# EAGLE design env_follower (EAGLE 9.5.2)
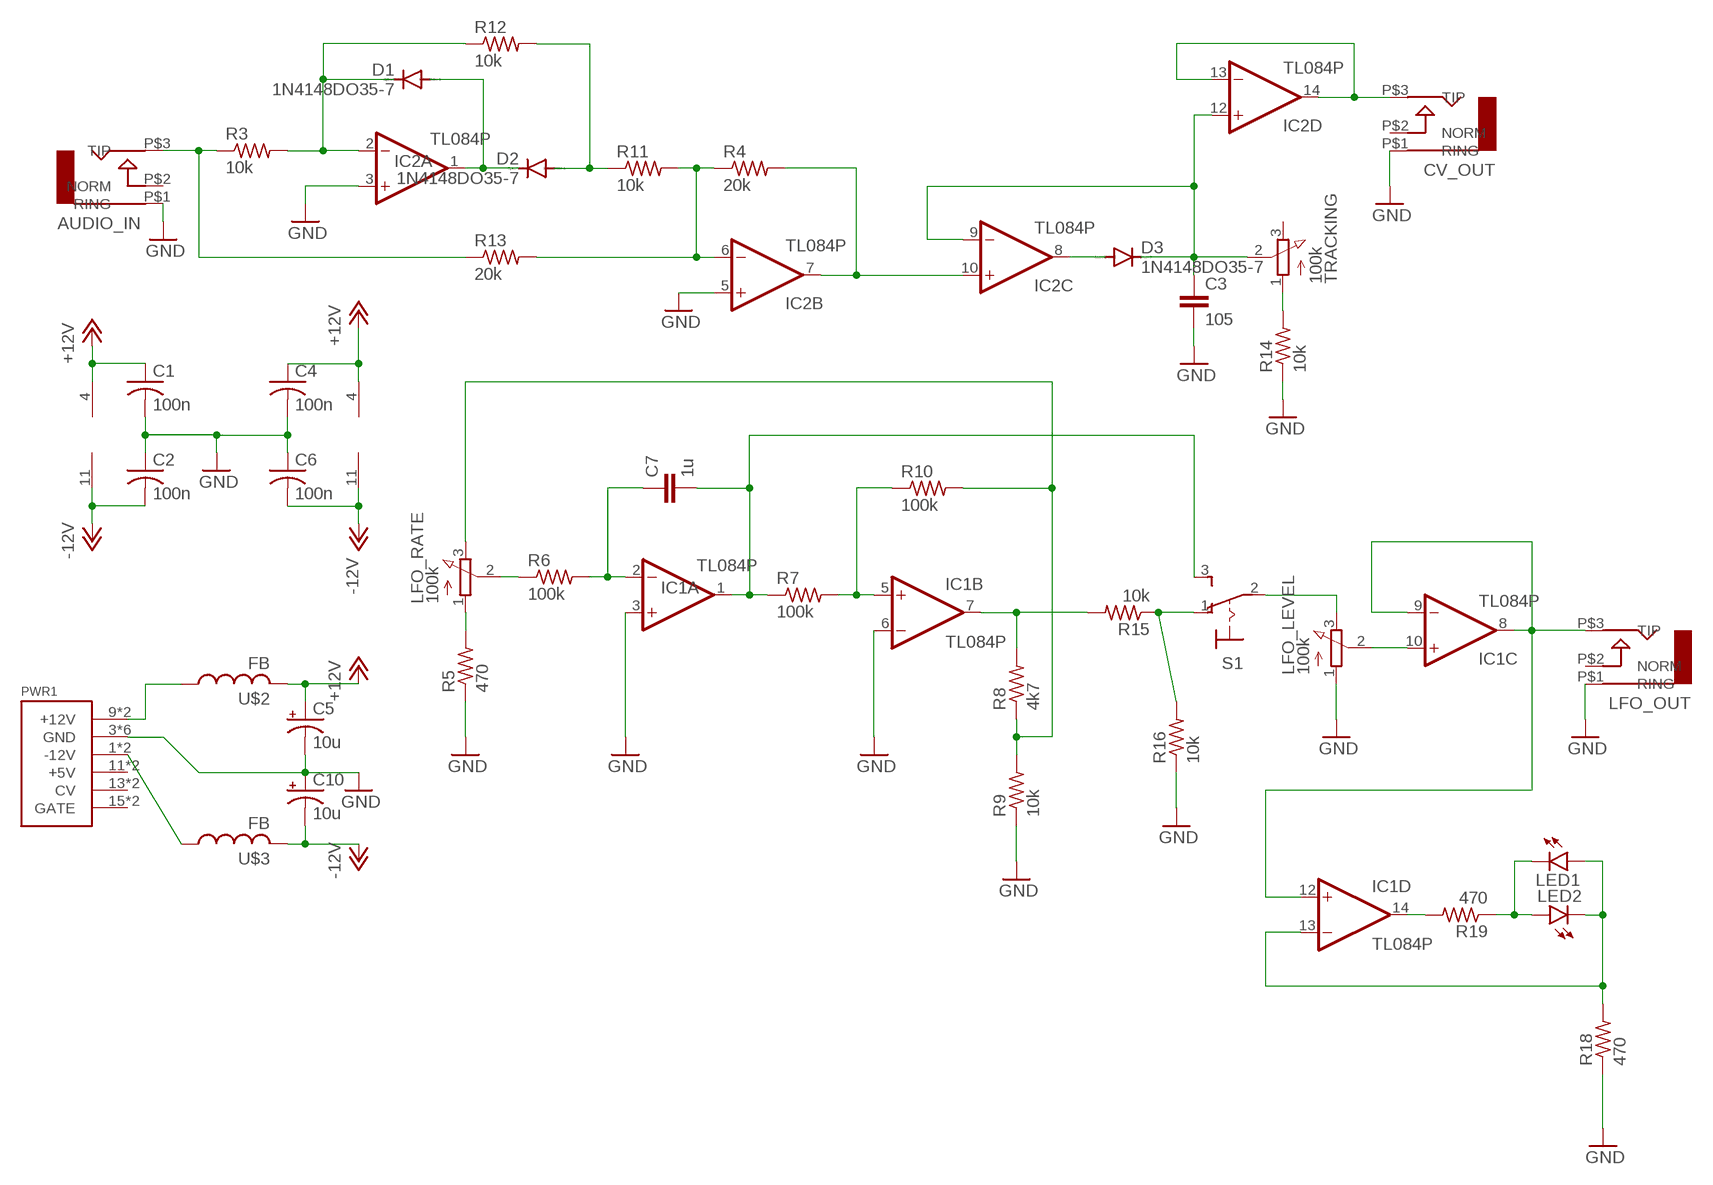
[diagram p0: schematic, sheet 1]

## Parts
AUDIO_IN  AUDIO-JACK  [ERTHENVAR-JACK-90DEG]
C1  100n  C-USC1206  [C1206]
C2  100n  C-USC1206  [C1206]
C3  105  C7.5/3  [C7.5B3]
C4  100n  C-USC1206  [C1206]
C5  10u  CPOL-USB45181A  [B45181A]
C6  100n  C-USC1206  [C1206]
C7  1u  C5/2.5  [C5B2.5]
C10  10u  CPOL-USB45181A  [B45181A]
CV_OUT  AUDIO-JACK  [ERTHENVAR-JACK-90DEG]
D1  1N4148DO35-7  [DO35-7]
D2  1N4148DO35-7  [DO35-7]
D3  1N4148DO35-7  [DO35-7]
IC1  TL084P  [DIL14]
IC2  TL084P  [DIL14]
LED1  LED3MM  [LED3MM]
LED2  LED3MM  [LED3MM]
LFO_LEVEL  100k  3RP/1610N  [3RP/1610N]
LFO_OUT  AUDIO-JACK  [ERTHENVAR-JACK-90DEG]
LFO_RATE  100k  3RP/1610N  [3RP/1610N]
PWR1  POWER  [POWER_16]
R3  10k  R-US_0207/7  [0207/7]
R4  20k  R-US_0207/7  [0207/7]
R5  470  R-US_0207/7  [0207/7]
R6  100k  R-US_0207/7  [0207/7]
R7  100k  R-US_0207/7  [0207/7]
R8  4k7  R-US_0207/7  [0207/7]
R9  10k  R-US_0207/7  [0207/7]
R10  100k  R-US_0207/7  [0207/7]
R11  10k  R-US_0207/7  [0207/7]
R12  10k  R-US_0207/7  [0207/7]
R13  20k  R-US_0207/7  [0207/7]
R14  10k  R-US_0207/7  [0207/7]
R15  10k  R-US_0207/7  [0207/7]
R16  10k  R-US_0207/7  [0207/7]
R18  470  R-US_0207/7  [0207/7]
R19  470  R-US_0207/7  [0207/7]
S1  M9040P  [M9040P]
TRACKING  100k  3RP/1610N  [3RP/1610N]
U$2  FB  [FB]
U$3  FB  [FB]

## Nets
+12V: C1.1 C4.1 C5.+ IC1.4(P:V+) IC2.4(P:V+) U$2.P$2
-12V: C2.2 C6.2 C10.- IC1.11(P:V-) IC2.11(P:V-) U$3.P$2
GND: AUDIO_IN.P$1(RING) C1.2 C2.1 C3.2 C4.2 C5.- C6.1 C10.+ CV_OUT.P$1(RING) IC1.3(A:+IN) IC1.6(B:-IN) IC2.3(A:+IN) IC2.5(B:+IN) LFO_LEVEL.1(A) LFO_OUT.P$1(RING) PWR1.3(GND) PWR1.4(GND) PWR1.5(GND) PWR1.6(GND) PWR1.7(GND) PWR1.8(GND) R5.1 R9.1 R14.1 R16.1 R18.1
N$1: LFO_RATE.1(A) R5.2
N$2: D1.C IC2.2(A:-IN) R3.2 R12.1
N$3: D1.A D2.C IC2.1(A:OUT)
N$4: D2.A R11.1 R12.2
N$5: CV_OUT.P$3(TIP) IC2.13(D:-IN) IC2.14(D:OUT)
N$6: LFO_RATE.2(S) R6.1
N$7: C7.1 IC1.2(A:-IN) R6.2
N$8: IC2.7(B:OUT) IC2.10(C:+IN) R4.2
N$9: AUDIO_IN.P$3(TIP) R3.1 R13.1
N$10: C7.2 IC1.1(A:OUT) R7.1 S1.3(S)
N$11: PWR1.9(+12V) PWR1.10(+12V) U$2.P$1
N$12: IC1.5(B:+IN) R7.2 R10.1
N$13: IC1.7(B:OUT) R8.2 R15.2
N$14: R15.1 R16.2 S1.1(O)
N$15: D3.A IC2.8(C:OUT)
N$16: LFO_RATE.3(E) R8.1 R9.2 R10.2
N$17: PWR1.1(-12V) PWR1.2(-12V) U$3.P$1
N$18: IC1.8(C:OUT) IC1.9(C:-IN) IC1.12(D:+IN) LFO_OUT.P$3(TIP)
N$19: LFO_LEVEL.3(E) S1.2(P)
N$20: IC2.6(B:-IN) R4.1 R11.2 R13.2
N$21: C3.1 D3.C IC2.9(C:-IN) IC2.12(D:+IN) TRACKING.2(S)
N$22: R14.2 TRACKING.1(A)
N$23: IC1.10(C:+IN) LFO_LEVEL.2(S)
N$24: IC1.14(D:OUT) R19.2
N$25: LED1.K(C) LED2.A R19.1
N$27: IC1.13(D:-IN) LED1.A LED2.K(C) R18.2
Unconnected: AUDIO_IN.P$2(NORM) CV_OUT.P$2(NORM) LFO_OUT.P$2(NORM) PWR1.11(+5V) PWR1.12(+5V) PWR1.13(CV) PWR1.14(CV) PWR1.15(GATE) PWR1.16(GATE) TRACKING.3(E)

## Library data of the parts
AUDIO_IN CV_OUT LFO_OUT = erthenvar:AUDIO-JACK: Switching Mono 3.5mm Audio Jack from Erthenvar.
C1 C2 C4 C6 = rcl:C-US: CAPACITOR, American symbol
C3 C7 = capacitor-wima:C: CAPACITOR naming: grid - package width
C5 C10 = rcl:CPOL-US: POLARIZED CAPACITOR, American symbol
D1-D3 = diode:1N4148: DIODE high speed (Philips)
IC1 IC2 = linear:TL084: OP AMP
LED1 LED2 = led:LED: LED OSRAM: - CHIPLED LG R971, LG N971, LY N971, LG Q971, LY Q971, LO R971, LY R971 LH N974, LH R974 LS Q976, LO Q976, LY Q976 LO Q996 - Hyper CHIPLED LW Q18S LB Q993, LB Q99A, LB R99A - SideLED LS A670, LO A670, LY A670, LG A670, LP A670 LB A673, LV A673, LT A673, LW A673 LH A674 LY A675 LS A676, LA A676, LO A676, LY A676, LW A676 LS A679, LY A679, LG A679 - Hyper Micro SIDELED® LS Y876, LA Y876, LO Y876, LY Y876 LT Y87S - SmartLED LW L88C, LW L88S LB L89C, LB L89S, LG L890 LS L89K, LO L89K, LY L89K LS L896, LA L896, LO L896, LY L896 - TOPLED LS T670, LO T670, LY T670, LG T670, LP T670 LSG T670, LSP T670, LSY T670, LOP T670, LYG T670 LG T671, LOG T671, LSG T671 LB T673, LV T673, LT T673, LW T673 LH T674 LS T676, LA T676, LO T676, LY T676, LB T676, LH T676, LSB T676, LW T676 LB T67C, LV T67C, LT T67C, LS T67K, LO T67K, LY T67K, LW E67C LS E67B, LA E67B, LO E67B, LY E67B, LB E67C, LV E67C, LT E67C LW T67C LS T679, LY T679, LG T679 LS T770, LO T770, LY T770, LG T770, LP T770 LB T773, LV T773, LT T773, LW T773 LH T774 LS E675, LA E675, LY E675, LS T675 LS T776, LA T776, LO T776, LY T776, LB T776 LHGB T686 LT T68C, LB T68C - Hyper Mini TOPLED® LB M676 - Mini TOPLED Santana® LG M470 LS M47K, LO M47K, LY M47K Source: http://www.osram.convergy.de LUXEON: - LUMILED® LXK2-PW12-R00, LXK2-PW12-S00, LXK2-PW14-U00, LXK2-PW14-V00 LXK2-PM12-R00, LXK2-PM12-S00, LXK2-PM14-U00 LXK2-PE12-Q00, LXK2-PE12-R00, LXK2-PE12-S00, LXK2-PE14-T00, LXK2-PE14-U00 LXK2-PB12-K00, LXK2-PB12-L00, LXK2-PB12-M00, LXK2-PB14-N00, LXK2-PB14-P00, LXK2-PB14-Q00 LXK2-PR12-L00, LXK2-PR12-M00, LXK2-PR14-Q00, LXK2-PR14-R00 LXK2-PD12-Q00, LXK2-PD12-R00, LXK2-PD12-S00 LXK2-PH12-R00, LXK2-PH12-S00 LXK2-PL12-P00, LXK2-PL12-Q00, LXK2-PL12-R00 Source: www.luxeon.com KINGBRIGHT: KA-3528ASYC Source: www.kingbright.com
LFO_LEVEL LFO_RATE TRACKING = pot:3RP/1610N: 16mm Potentiometer one level Source: http://www.alphapotentiometers.net/html/16mm_pot_2.html
PWR1 = eurorack:POWER
R3-R16 R18 R19 = rcl:R-US_: RESISTOR, American symbol
S1 = switch:M9040P: TOGGLE SWITCH Marquardt
U$2 U$3 = adafruit:FB: Ferrite bead Digikey #P9821BK-ND

## Board
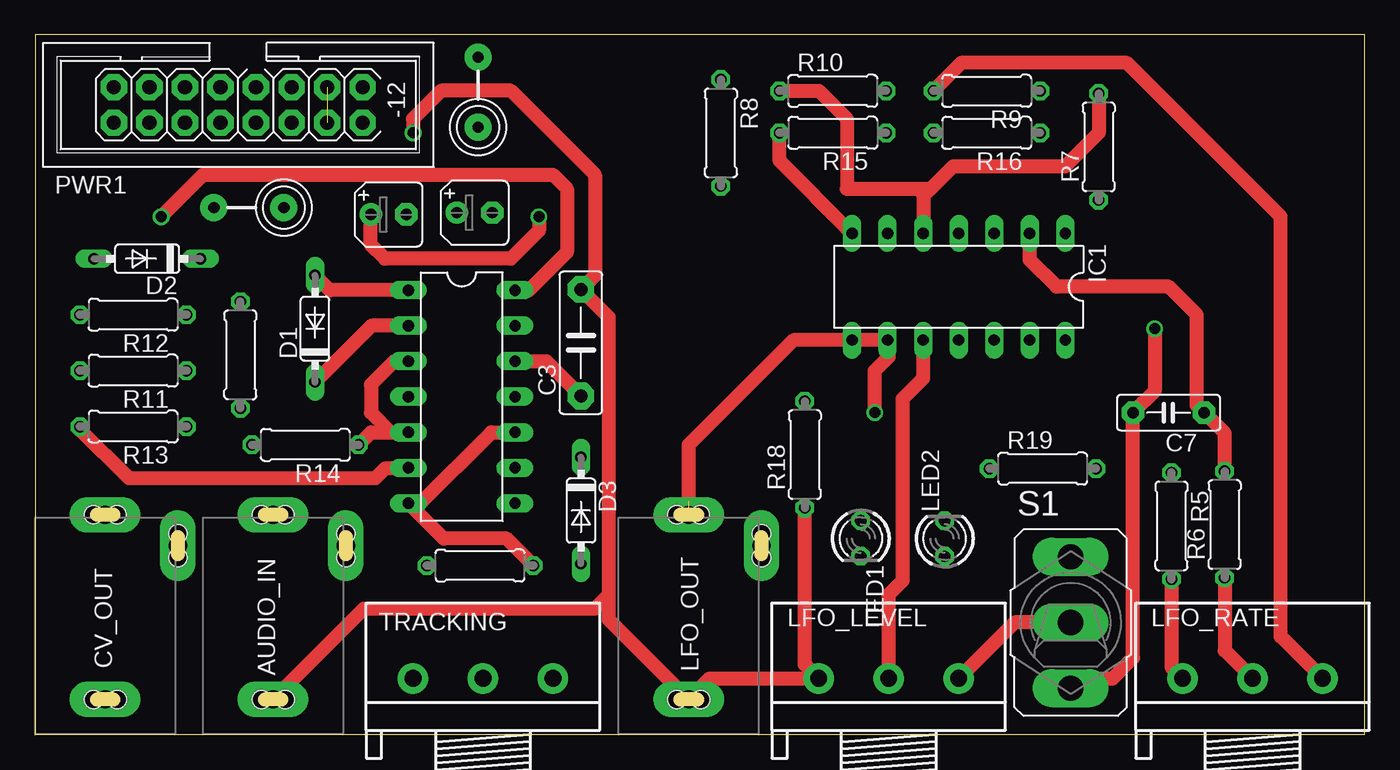
[diagram p1: board, top side]
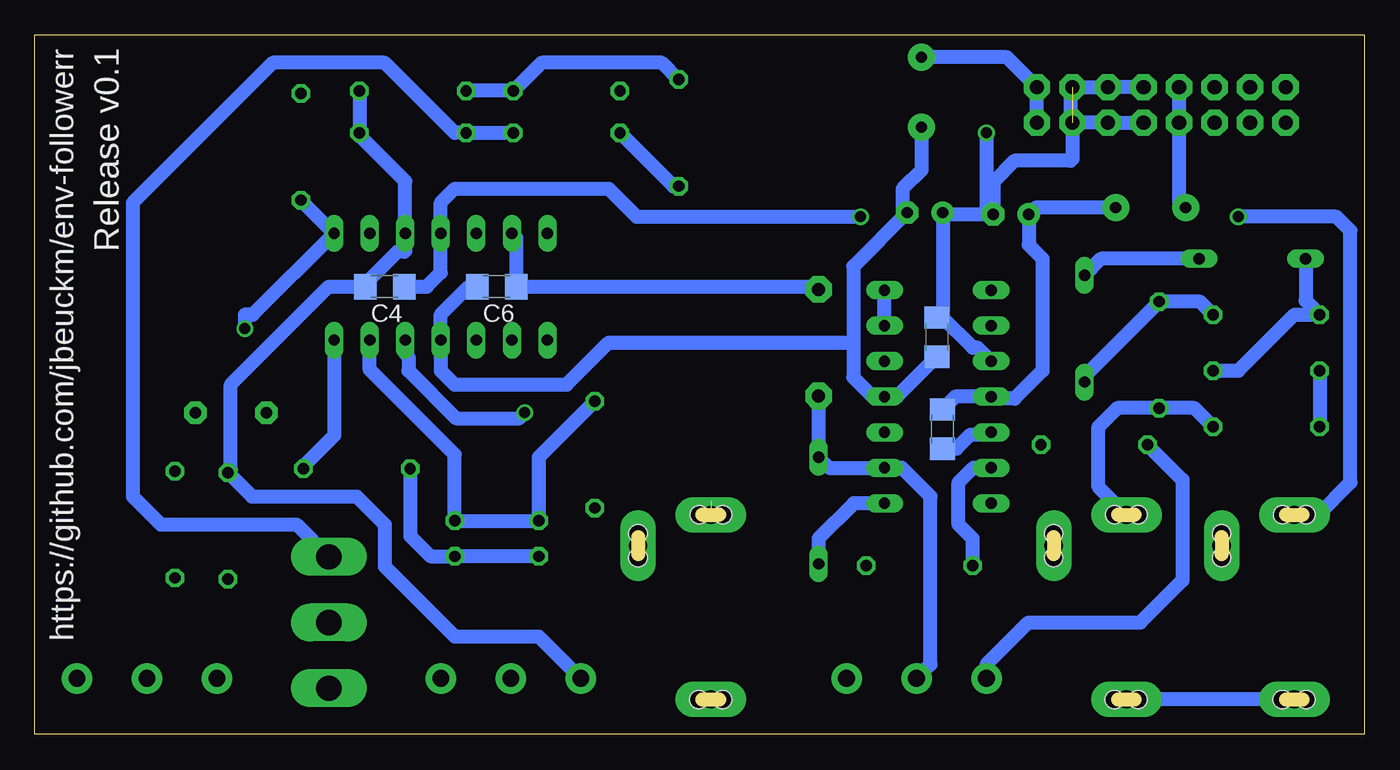
[diagram p2: board, bottom side, seen from below]

Size 95 x 50 mm. Coordinates in mm from the lower left corner, seen from the top.
Outline: 0,0 95,0 95,50 0,50 0,0
Copper layers (1*16): Top 0.035mm / dielectric 1.5mm / Bottom 0.035mm
Design rules "default *": minimum track width 28mil, minimum drill 31mil, track to track 16mil, track to pad 16mil, pad to pad 16mil, via to via 16mil, smd to smd 8mil, copper to edge 0mil, drill to drill 16mil, minimum pad ring 10mil, minimum via ring 8mil, stop-mask expansion 4mil, vias tented up to drill 0mil, thermal gap 10mil

### Footprints (pad centres in the part's own frame; a part is rotated, then mirrored left to right if it is on the bottom)
ERTHENVAR-JACK-90DEG = drill 1.3 pad 2.54 long: P$1 5,-2.5; P$2 -0.2,-13.5; P$3 5,-15.7 | hole 1.3: 5.842,-2.489; 4.14,-2.489; -0.203,-12.649; -0.203,-14.351; 5.842,-15.697; 4.166,-15.697
C1206 = smd 1.6 x 1.8: 1 -1.4,0; 2 1.4,0
C7.5B3 = drill 0.914 pad 1.905 octagon: 1 -3.81,0; 2 3.81,0
B45181A = drill 0.813 pad 1.6: + -1.27,0 | drill 0.813 pad 1.6 octagon: - 1.27,0
C5B2.5 = drill 0.813 pad 1.6 octagon: 1 -2.54,0; 2 2.54,0
DO35-7 = drill 0.813 long: A 3.81,0; C -3.81,0
DIL14 = drill 0.813 long: 1 -7.62,-3.81; 2 -5.08,-3.81; 3 -2.54,-3.81; 4 0,-3.81; 5 2.54,-3.81; 6 5.08,-3.81; 7 7.62,-3.81; 8 7.62,3.81; 9 5.08,3.81; 10 2.54,3.81; 11 0,3.81; 12 -2.54,3.81; 13 -5.08,3.81; 14 -7.62,3.81
LED3MM = drill 0.813 octagon: A -1.27,0; K 1.27,0
3RP/1610N = drill 1.2 pad 2.184: 1 -5,0; 2 0,0; 3 5,0
POWER_16 = drill 1.016 pad 1.88 octagon: 1 -6.35,-1.27; 2 -6.35,1.27; 3 -3.81,-1.27; 4 -3.81,1.27; 5 -1.27,-1.27; 6 -1.27,1.27; 7 1.27,-1.27; 8 1.27,1.27; 9 3.81,-1.27; 10 3.81,1.27; 11 6.35,-1.27; 12 6.35,1.27; 13 8.89,-1.27; 14 8.89,1.27; 15 11.43,-1.27; 16 11.43,1.27
0207/7 = drill 0.813 octagon: 1 -3.81,0; 2 3.81,0
M9040P = drill 1.803 long: 1 0,4.699; 2 0,0; 3 0,-4.699
FB = drill 0.8 pad 1.93: P$1 -2.5,0; P$2 2.5,0

### Placement (x,y rotation side)
AUDIO_IN  22,0 180 top
C1  30.14,21.83 270 bottom
C2  30.54,28.4 270 bottom
C3  39,28 90 top
C4  70,32 180 bottom
C5  25.25,37.17 0 top
C6  62,32 180 bottom
C7  81,23 180 top
C10  31.4,37.3 0 top
CV_OUT  10,0 180 top
D1  20,29 90 top
D2  8,34 180 top
D3  39,16 270 top
IC1  66,32 180 top
IC2  30.48,24.14 270 top
LED1  59,14 270 top
LED2  65,14 90 top
LFO_LEVEL  61,4 0 top
LFO_OUT  51.7,0 180 top
LFO_RATE  87,4 0 top
PWR1  17.05,45 180 top
R3  14.66,27.13 90 top
R4  31.79,12.07 0 top
R5  81.2,14.9 270 top
R6  85,15 90 top
R7  76,42 90 top
R8  49,43 270 top
R9  68,46 180 top
R10  57,46 0 top
R11  7,26 180 top
R12  7,30 180 top
R13  7,22 180 top
R14  19.3,20.7 180 top
R15  57,43 180 top
R16  68,43 180 top
R18  55,20 90 top
R19  72,19 0 top
S1  74,8 0 top
TRACKING  32,4 0 top
U$2  15.27,37.65 0 top
U$3  31.65,45.9 270 top

### Tracks (layer width: path | path; a pad name or v marks a point on that pad's centre or on a via)
+12V  (via drill 0.79)
  Top 1.016: v36,37 36,36 34,34 25,34 23.98,35.02 C5.+
  Bottom 1.016: C1.1 29.23,24.14 IC2.4 26.53,24 25,24 23,26 23,34 23.98,34.98 C5.+ 23.5,37.65 U$2.P$2 | C4.1 67,32 66,33 IC1.4 66,38 65,39 54,39 52,37 v36,37
-12V
  Bottom 1.016: C2.2 33.4,24.14 IC2.11 34.43,24 35,24 36.52,25.52 36.52,28 | U$3.P$2 31.65,40.35 33,39 33,37.63 C10.- 36.52,33.45 36.52,28 | C6.2 64,32 66,30 IC1.11 66,26 65,25 57,25 54,28 36.52,28
GND  (via drill 0.79)  (1 unrouted)
  Top 1.016: v27,43 27,44 29,46 34,46 40,40 40,32.81 C3.2 41,29.81 41,10 | IC2.3 25.68,26.68 24,25 24,23 25.4,21.6 IC2.5 24.01,21.6 R14.1 | AUDIO_IN.P$1 23.5,9 40,9 41,10 | 41,10 41,8.2 LFO_OUT.P$1 48.2,4 LFO_LEVEL.1 55,5 R18.1
  Bottom 1.016: PWR1.8 PWR1.6 20.73,43.73 21,44 21,46.13 PWR1.3 PWR1.5 PWR1.7 | PWR1.4 20.86,41.14 21,41 25,41 26.52,39.48 C5.- | C5.- 30,37.17 C10.+ 30.13,30.21 C2.1 30.14,29.8 27.98,27.64 27.64,27.64 IC2.3 | CV_OUT.P$1 AUDIO_IN.P$1 | v27,43 27,37.65 C5.- | C1.2 29.14,20.43 28.14,21.43 26.57,21.43 26.67,21.53 IC2.5 | IC1.6 60.6,35.49 C6.1 39.19,32 C3.2 | R9.1 R16.1 71.81,42.81 68.54,39.54 IC1.3 68.54,34.56 68.6,34.5 69.09,34.5 71.4,32.19 C4.2 74,32 81,25 81,18.91 R5.1 79.49,17 72,17 70,15 70,12 65,7 59,7 LFO_LEVEL.1
N$1
  Top 1.016: LFO_RATE.1 81.2,4.8 R5.2
N$2
  Top 1.016: IC2.2 24.03,29.22 D1.C
  Bottom 1.016: R12.1 11.75,30.94 R3.2 20,25.6 D1.C
N$3
  Top 1.016: IC2.1 21.05,31.76 D1.A
  Bottom 1.016: D2.C 18.81,34 D1.A
N$4
  Bottom 1.016: R11.1 9,26 5,30 R12.2 4.19,31 D2.A
N$5  (via drill 0.79)
  Top 1.016: v9,37 12,40 37,40 38,39 38,34.47 35.29,31.76 IC2.14
  Bottom 1.016: IC2.13 IC2.14 | CV_OUT.P$3 3.3,15.7 1,18 1,36 2,37 v9,37
N$6
  Top 1.016: LFO_RATE.2 85,6 R6.1
N$7
  Top 1.016: R6.2 85,21.54 C7.1 83,23.54 83,30 81,32 73,32 71.08,33.92 IC1.2
N$8
  Top 1.016: IC2.10 32.6,21.6 27.52,16.52 IC2.7 29.19,14 33.67,14 R4.2
N$9
  Bottom 1.016: R13.1 12.13,23.32 R3.1 17.66,23.32 19,21.98 19,17.7 AUDIO_IN.P$3
N$10  (via drill 0.79)
  Top 1.016: S1.3 74.7,4 77,4 78.46,5.46 C7.2 80,24.54 v80,29
  Bottom 1.016: R7.1 IC1.1 79.43,30 80,30 v80,29
N$11
  Bottom 1.016: PWR1.9 PWR1.10 13.24,38.12 U$2.P$1
N$12
  Top 1.016: R10.1 56,46 58,44 58,39 64,39 | 64,39 65.6,40.6 73.6,40.6 76,43 R7.2 | 64,39 63.46,38.54 IC1.5
N$13
  Top 1.016: IC1.7 53.19,41 R15.2
  Bottom 1.016: R15.2 49.38,39.19 R8.2
N$14
  Bottom 1.016: R15.1 R16.2 65,43 70,48 78,48 88,38 88,17 86,15 76.3,15 S1.1
N$15
  Bottom 1.016: IC2.8 36.48,16.52 39,14 D3.A 39,12
N$16
  Top 1.016: LFO_RATE.3 89,7 89,37 78,48 66.19,48 R9.2
  Bottom 1.016: R8.1 50.19,48 58.81,48 R10.2 R9.2
N$17
  Bottom 1.016: PWR1.2 PWR1.1 25.53,48.4 U$3.P$1
N$18  (via drill 0.79)  (1 unrouted)
  Top 1.016: v60,23 60,26 61,27 61,28.11 IC1.9 IC1.8 54.19,28.19 46.7,20.7 46.7,16.7
  Bottom 1.016: IC1.12 68.54,27.24 68.3,27 68.3,26 64.9,22.6 60.4,22.6 v60,23
N$19
  Top 1.016: S1.2 70,8 LFO_LEVEL.3
N$20
  Top 0.711: IC2.6 26.61,19 | 3.19,21.81 R13.2
  Top 1.016: 26.61,19 25,19 24.3,18.3 6.7,18.3 3.19,21.81
  Bottom 1.016: R11.2 R13.2 | R4.1 27.98,13.98 29,15 29,18 27.99,19.01 27.98,19.01 27.93,19.06 IC2.6
N$21
  Top 1.016: IC2.12 36.51,26.68 C3.1
  Bottom 1.016: C3.1 D3.C 38.25,19.06 IC2.9 33.06,19.06 31,17 31,5 TRACKING.2
N$22
  Bottom 1.016: TRACKING.1 27,5 24,8 16,8 12.99,11.01 12.99,18.2 R14.2
N$23
  Top 1.016: LFO_LEVEL.2 61,10 62,11 62,24 63.46,25.46 IC1.10
N$24
  Bottom 1.016: IC1.14 73.62,21.38 75.81,19.19 R19.2
N$25
  Bottom 1.016: LED1.K LED2.A 66.73,12.73 68.19,14.19 R19.1
N$27
  Bottom 1.016: R18.2 59,19.81 LED1.A LED2.K 65,20 71.08,26.08 IC1.13

### Text on the board
bNames: Release v0.1 | https://github.com/jbeuckm/env-followerr